# Altium schematic sheet CSM_Esquematico.SchDoc
size A3; SheetNumber: 1; SheetTotal: 1
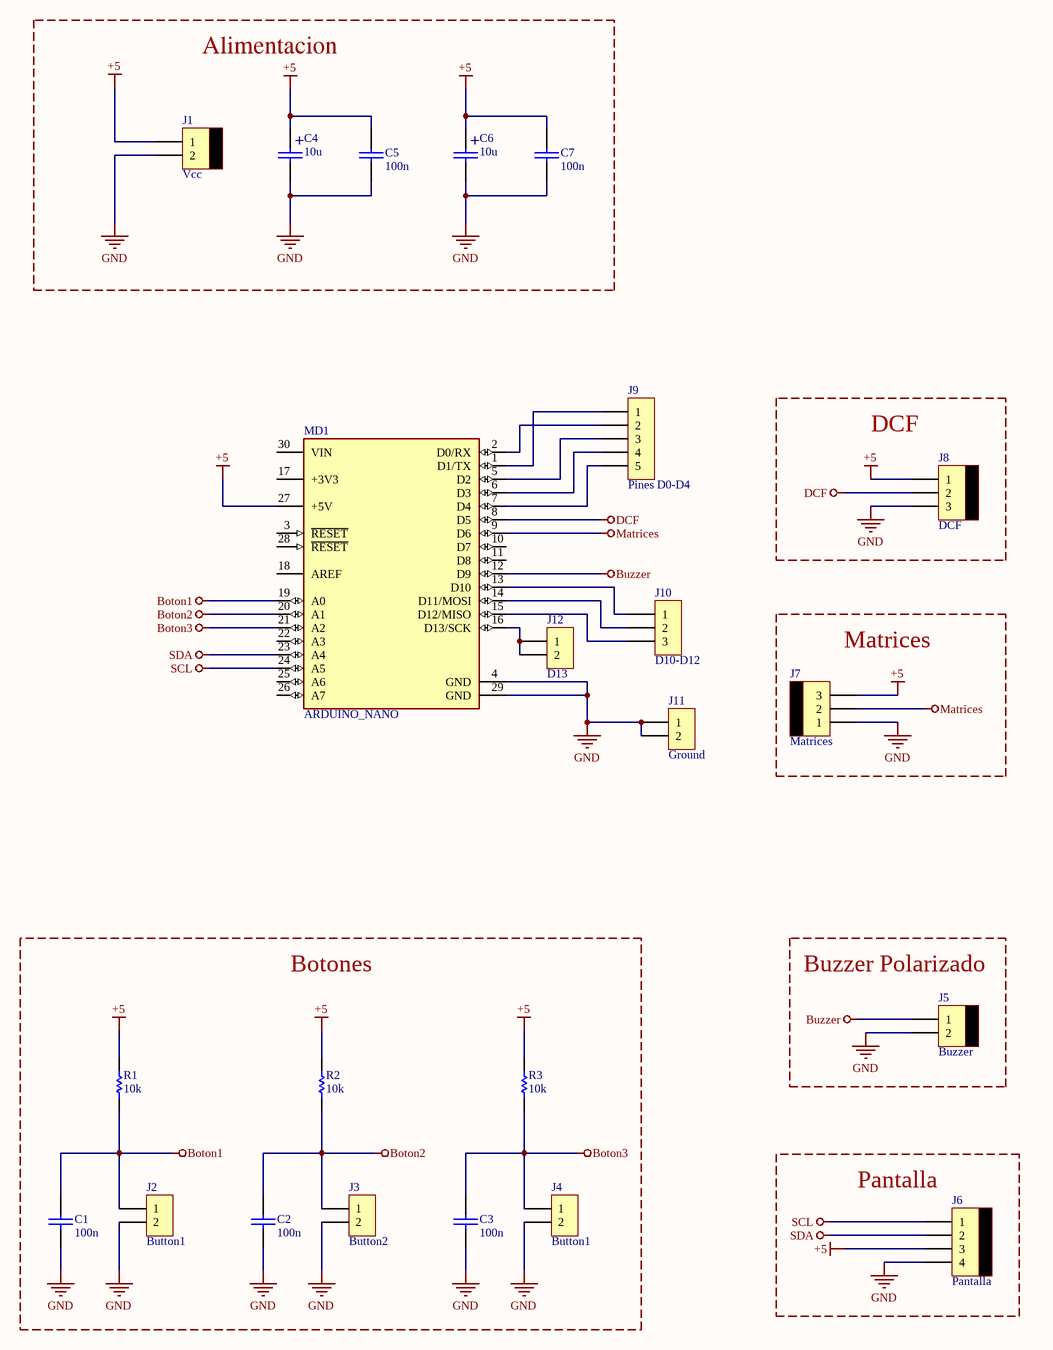
[diagram p0: CSM_Esquematico.SchDoc]

## Parts
C1  100n  [0805]
C2  100n  [0805]
C3  100n  [0805]
C4  10u  [CAP100RP]
C5  100n  [CAP200]
C6  10u  [CAP100RP]
C7  100n  [CAP200]
J1  Vcc  [MOLEX2]
J2  Button1  [SIP2]
J3  Button2  [SIP2]
J4  Button1  [SIP2]
J5  Buzzer  [MOLEX2]
J6  Pantalla  [MOLEX4]
J7  Matrices  [MOLEX3]
J8  DCF  [MOLEX3]
J9  Pines D0-D4  [SIP5]
J10  D10-D12  [SIP3]
J11  Ground  [SIP2]
J12  D13  [SIP2]
MD1  ARDUINO_NANO  [FP-A000005-MFG]
R1  10k  [0805]
R2  10k  [0805]
R3  10k  [0805]

## Blocks framed on the sheet
Alimentacion: C4-C7 J1
DCF: J8
Matrices: J7
Botones: C1-C3 J2-J4 R1-R3
Buzzer Polarizado: J5
Pantalla: J6

## Nets
+5: C4.1 C5.1 C6.1 C7.1 J1.1 J6.3 J7.3 J8.1 MD1.27(+5V) R1.1 R2.1 R3.1
Boton1: C1.1 J2.1 MD1.19(A0) R1.2
Boton2: C2.1 J3.1 MD1.20(A1) R2.2
Boton3: C3.1 J4.1 MD1.21(A2) R3.2
Buzzer: J5.1 MD1.12(D9)
DCF: J8.2 MD1.8(D5)
GND: C1.2 C2.2 C3.2 C4.2 C5.2 C6.2 C7.2 J1.2 J2.2 J3.2 J4.2 J5.2 J6.4 J7.1 J8.3 J11.1 J11.2 MD1.4(GND) MD1.29(GND)
Matrices: J7.2 MD1.9(D6)
SCL: J6.1 MD1.24(A5)
SDA: J6.2 MD1.23(A4)
NetJ9_1: J9.1 MD1.1(D1/TX)
NetJ9_2: J9.2 MD1.2(D0/RX)
NetJ9_3: J9.3 MD1.5(D2)
NetJ9_4: J9.4 MD1.6(D3)
NetJ9_5: J9.5 MD1.7(D4)
NetJ10_1: J10.1 MD1.13(D10)
NetJ10_2: J10.2 MD1.14(D11/MOSI)
NetJ10_3: J10.3 MD1.15(D12/MISO)
NetJ12_1: J12.1 J12.2 MD1.16(D13/SCK)

Not connected (* = marked no-connect by the designer): MD1 3(~{RESET}) 10(D7) 11(D8) 17(+3V3) 18(AREF) 22(A3) 25(A6) 26(A7) 28(~{RESET}) 30(VIN)

## Notes on the sheet
- (in symbol CAPPOL) +

## Library data of the parts
C1-C3 C5 C7 = CAP
C4 C6 = CAPPOL
J1 = MOLEX2: Tensión de alimentación
J2-J4 J11 J12 = CON2
J5 = MOLEX2
J6 = MOLEX4
J7 J8 = MOLEX3
J9 = CON5
J10 = CON3
MD1 = CMP-189986-000002-1: ARDUINO NANO ATMEGA328 EVAL BRD; Number of Bits: 8; Evaluation Kit: Yes; Operating Supply Voltage: 12V; Interface: I2C; Data Bus Width: 8b; Core Architecture: AVR; Packaging: Bulk; Length: 7inch; Package Quantity: 50; Width: 5inch; REACH SVHC: No SVHC; Weight: 0.358383oz; Series: AVR® ATmega; Height: 0.25inch
R1-R3 = RES